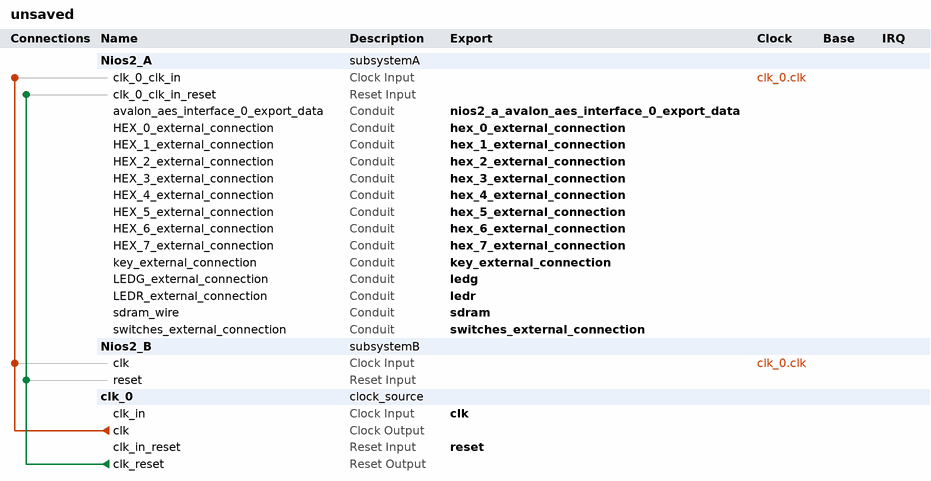
[diagram p0: system contents]
# Platform Designer (Qsys) system unsaved, Cyclone IV E EP4CE115F29C7
# Parameters at their usual value, and those the tool derives, are not listed.
package require -exact qsys 16.1
create_system unsaved
set_project_property DEVICE_FAMILY {Cyclone IV E}
set_project_property DEVICE EP4CE115F29C7

add_instance Nios2_A subsystemA 1.0

add_instance Nios2_B subsystemB 1.0

add_instance clk_0 clock_source 16.1
set_instance_parameter_value clk_0 clockFrequency 50000000

# connections
add_connection clk_0.clk Nios2_A.clk_0_clk_in clock
add_connection clk_0.clk Nios2_B.clk clock
add_connection clk_0.clk_reset Nios2_A.clk_0_clk_in_reset reset
add_connection clk_0.clk_reset Nios2_B.reset reset

# exported interfaces
add_interface clk clock sink
set_interface_property clk EXPORT_OF clk_0.clk_in
add_interface hex_0_external_connection conduit end
set_interface_property hex_0_external_connection EXPORT_OF Nios2_A.HEX_0_external_connection
add_interface hex_1_external_connection conduit end
set_interface_property hex_1_external_connection EXPORT_OF Nios2_A.HEX_1_external_connection
add_interface hex_2_external_connection conduit end
set_interface_property hex_2_external_connection EXPORT_OF Nios2_A.HEX_2_external_connection
add_interface hex_3_external_connection conduit end
set_interface_property hex_3_external_connection EXPORT_OF Nios2_A.HEX_3_external_connection
add_interface hex_4_external_connection conduit end
set_interface_property hex_4_external_connection EXPORT_OF Nios2_A.HEX_4_external_connection
add_interface hex_5_external_connection conduit end
set_interface_property hex_5_external_connection EXPORT_OF Nios2_A.HEX_5_external_connection
add_interface hex_6_external_connection conduit end
set_interface_property hex_6_external_connection EXPORT_OF Nios2_A.HEX_6_external_connection
add_interface hex_7_external_connection conduit end
set_interface_property hex_7_external_connection EXPORT_OF Nios2_A.HEX_7_external_connection
add_interface key_external_connection conduit end
set_interface_property key_external_connection EXPORT_OF Nios2_A.key_external_connection
add_interface ledg conduit end
set_interface_property ledg EXPORT_OF Nios2_A.LEDG_external_connection
add_interface ledr conduit end
set_interface_property ledr EXPORT_OF Nios2_A.LEDR_external_connection
add_interface nios2_a_avalon_aes_interface_0_export_data conduit end
set_interface_property nios2_a_avalon_aes_interface_0_export_data EXPORT_OF Nios2_A.avalon_aes_interface_0_export_data
add_interface reset reset sink
set_interface_property reset EXPORT_OF clk_0.clk_in_reset
add_interface sdram conduit end
set_interface_property sdram EXPORT_OF Nios2_A.sdram_wire
add_interface switches_external_connection conduit end
set_interface_property switches_external_connection EXPORT_OF Nios2_A.switches_external_connection

set_interconnect_requirement {$system} qsys_mm.clockCrossingAdapter HANDSHAKE
set_interconnect_requirement {$system} qsys_mm.enableEccProtection FALSE
set_interconnect_requirement {$system} qsys_mm.insertDefaultSlave FALSE
set_interconnect_requirement {$system} qsys_mm.maxAdditionalLatency 1

save_system unsaved.qsys
